# EasyEDA Pro project 毕设.eprj, schematic Schematic2
Board Name: 电源板; Create Date: 2025-04-13; Page Name: P1; Project Name: 毕设; Schematic Name: Schematic2; Update Date: 2025-04-14; Company: 嘉立创EDA; Page Size: A4; Version: V1.0
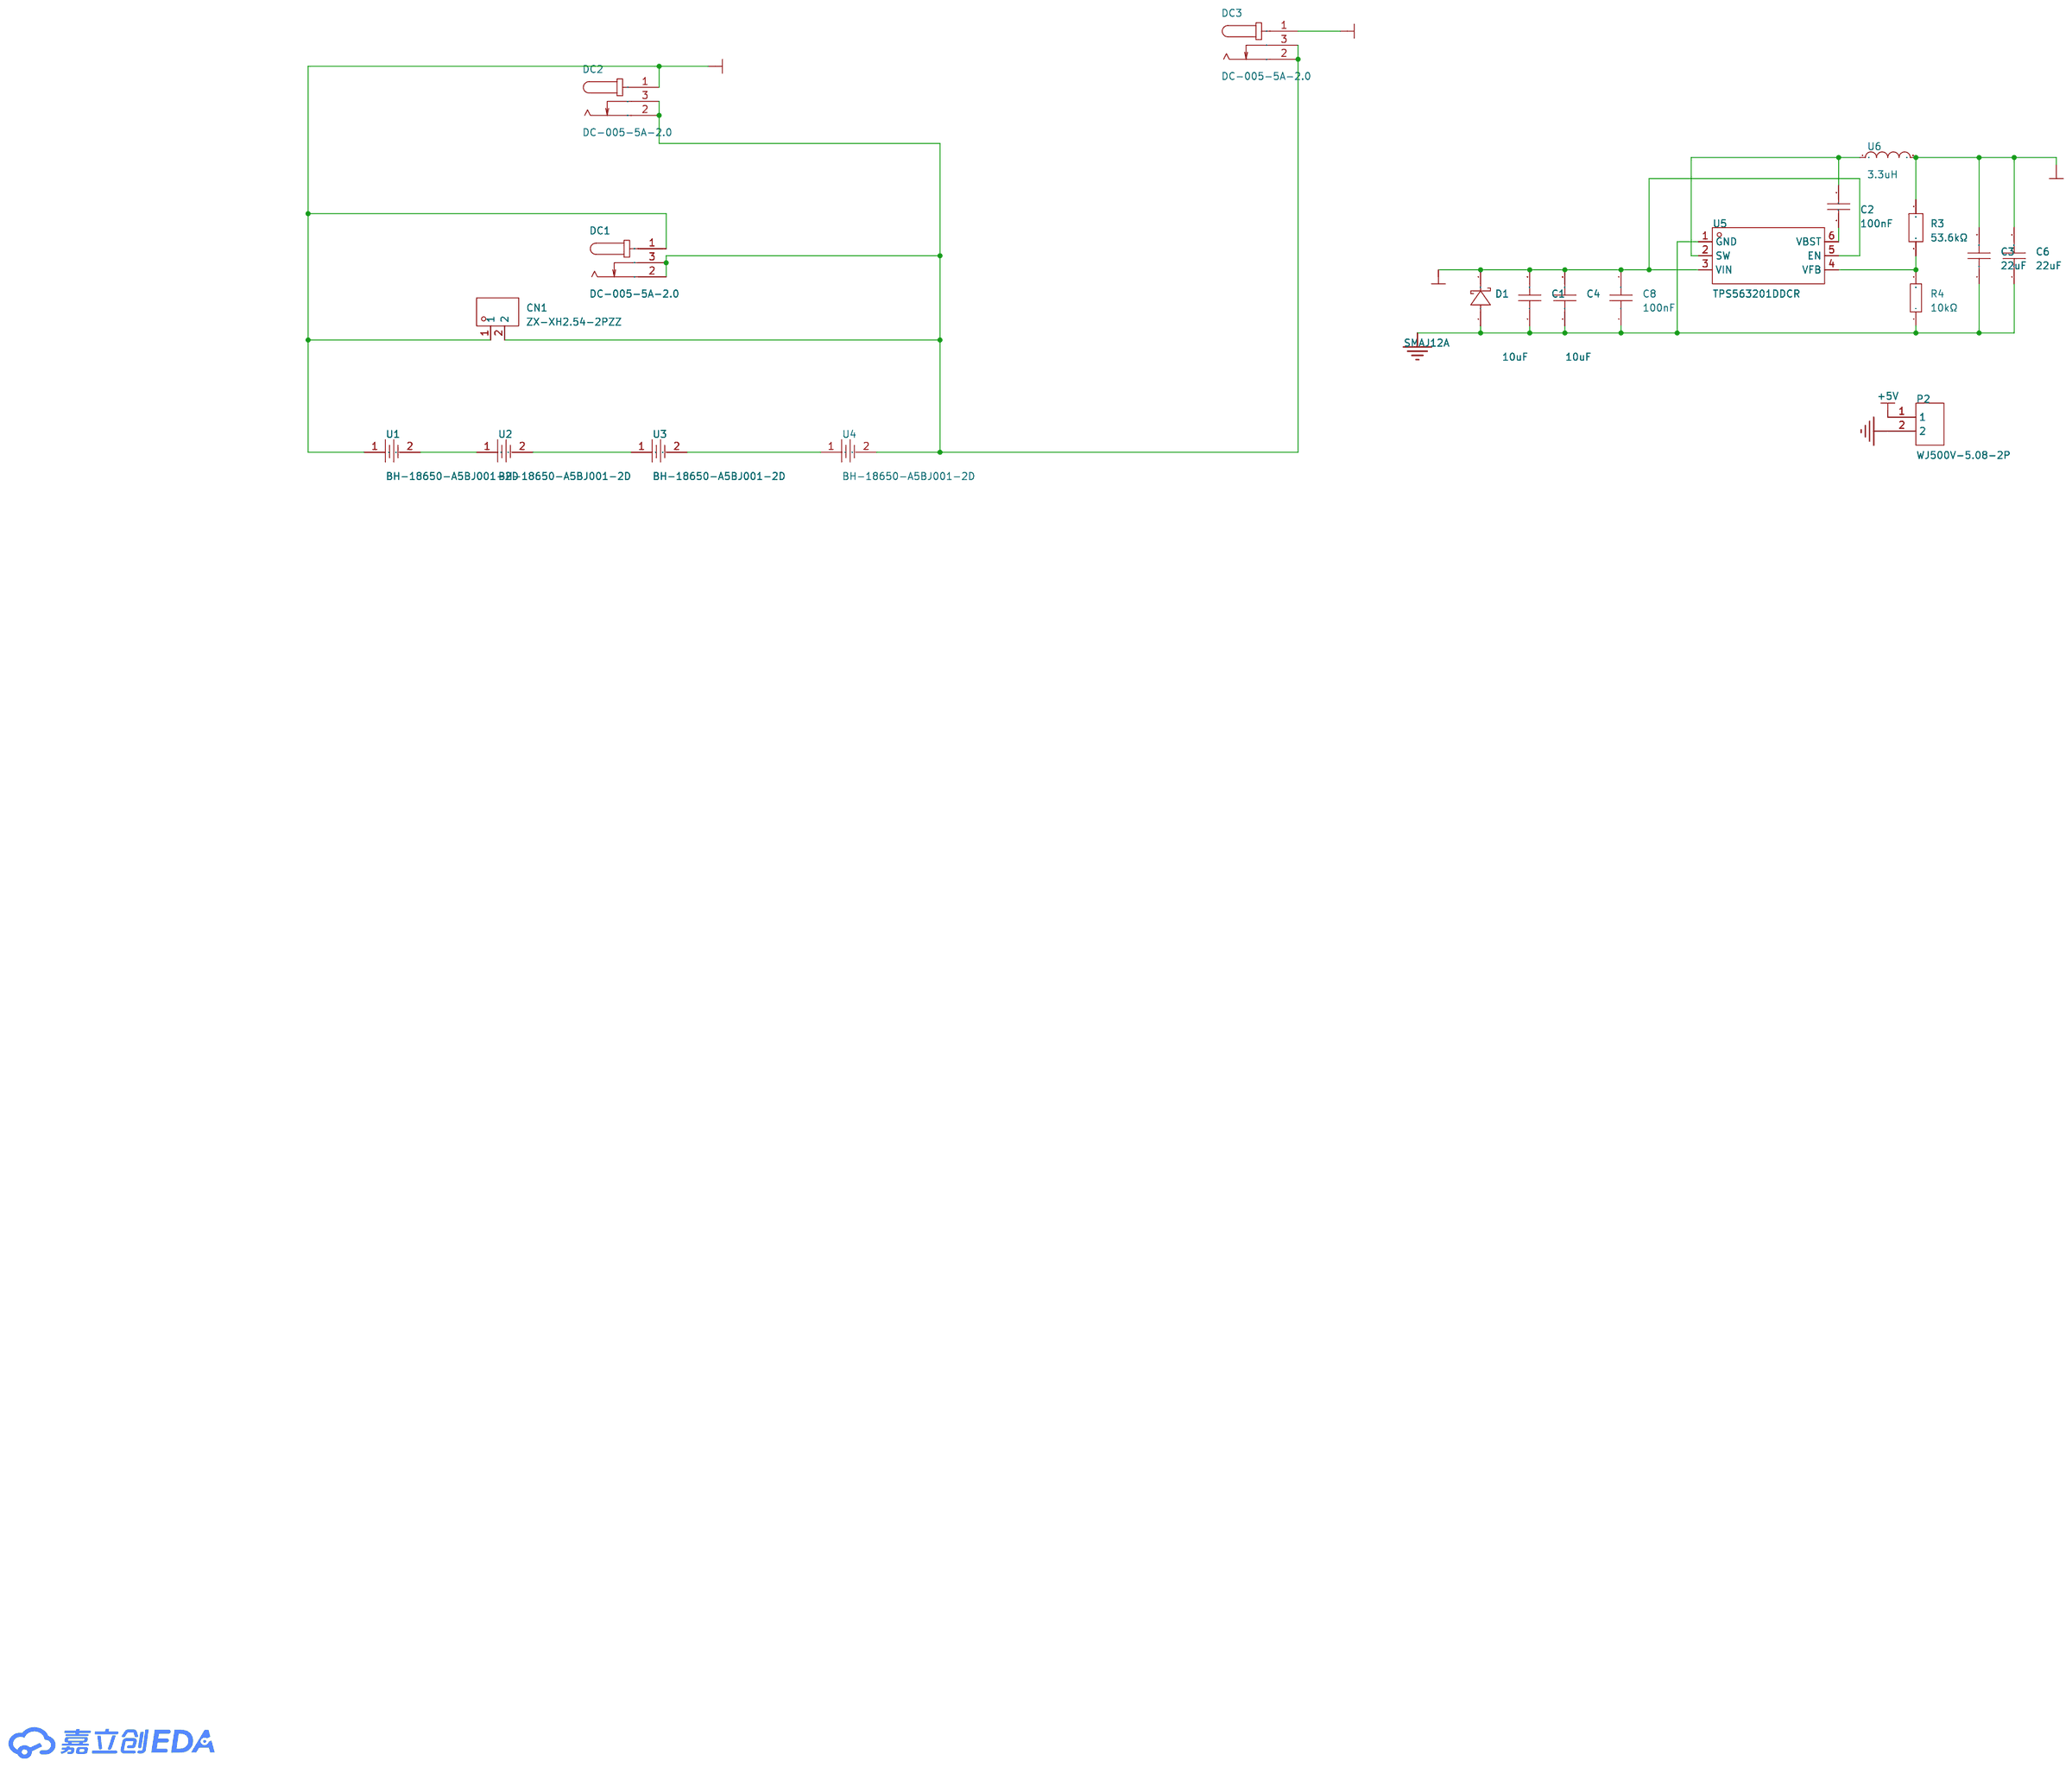
[diagram p1: schematic sheet]

## Parts
C1  10uF  [C0805]
C2  100nF  [C0603]
C3  22uF  [C0603]
C4  10uF  [C0805]
C6  22uF  [C0603]
C8  100nF  [C0603]
CN1  ZX-XH2.54-2PZZ  [CONN-TH_2P-P2.50_HX25003-2A]
D1  SMAJ12A  [DO-214AC_L4.3-W2.7-LS5.0-RD]
DC1  DC-005-5A-2.0  [DC-IN-TH_DC-005-5A-2.0]
DC2  DC-005-5A-2.0  [DC-IN-TH_DC-005-5A-2.0]
DC3  DC-005-5A-2.0  [DC-IN-TH_DC-005-5A-2.0]
P2  WJ500V-5.08-2P  [CONN-TH_2P-P5.00_WJ500V-5.08-2P]
R3  53.6kΩ  [R0603]
R4  10kΩ  [R0603]
U1  BH-18650-A5BJ001-2D  [BAT-TH_BH-18650-A5BJ001-2D]
U2  BH-18650-A5BJ001-2D  [BAT-TH_BH-18650-A5BJ001-2D]
U3  BH-18650-A5BJ001-2D  [BAT-TH_BH-18650-A5BJ001-2D]
U4  BH-18650-A5BJ001-2D  [BAT-TH_BH-18650-A5BJ001-2D]
U5  TPS563201DDCR  [SOT-23-6_L2.9-W1.6-P0.95-LS2.8-BR]
U6  3.3uH  [IND-SMD_L7.4-W6.6]

## Library data of the parts
C1 C4 = CGA0805X5R106K350MT: 容值:10uF;精度:±10%;额定电压:35V;材质(温度系数):X5R;; LCSC Part Name: 10uF ±10% 35V; Supplier Part: C6119888; Manufacturer: HRE(芯声); Supplier Footprint: 0805; JLCPCB Part Class: 扩展库; Supplier: LCSC; Tolerance: ±10%; Voltage Rated: 35V; Temperature Coefficient: X5R
C2 = CL10B104KA8NNNC: 容值:100nF;精度:±10%;额定电压:25V;材质(温度系数):X7R;; LCSC Part Name: 100nF ±10% 25V; Supplier Part: C1590; Manufacturer: SAMSUNG(三星); Supplier Footprint: 0603; JLCPCB Part Class: 扩展库; Datasheet: https://atta.szlcsc.com/upload/public/pdf/source/20160218/1457707763339.pdf; Supplier: LCSC; Tolerance: ±10%; Voltage Rated: 25V; Temperature Coefficient: X7R
C3 C6 = HGC0603R5226M100NTHJ: 容值:22uF;精度:±20%;额定电压:10V;材质(温度系数):X5R;; LCSC Part Name: 22uF ±20% 10V; Supplier Part: C7432770; Manufacturer: Chinocera(华瓷); Supplier Footprint: 0603; JLCPCB Part Class: 扩展库; Datasheet: https://atta.szlcsc.com/upload/public/pdf/source/20240320/FAC3FEC40A78BC5CCCE96C232A94D860.pdf; Supplier: LCSC; Tolerance: ±20%; Voltage Rated: 10V; Temperature Coefficient: X5R
C8 = CGA0603X7R104K500JT: 容值:100nF;精度:±10%;额定电压:50V;材质(温度系数):X7R;; LCSC Part Name: 100nF ±10% 50V; Supplier Part: C6119867; Manufacturer: HRE(芯声); Supplier Footprint: 0603; JLCPCB Part Class: 扩展库; Supplier: LCSC; Tolerance: ±10%; Voltage Rated: 50V; Temperature Coefficient: X7R
CN1 = ZX-XH2.54-2PZZ: LCSC Part Name: 1x2P 间距:2.5mm 直插 系列:XH; Supplier Part: C7429632; Manufacturer: Megastar(兆星); Supplier Footprint: 插件,P=2.5mm; JLCPCB Part Class: 扩展库; Datasheet: https://atta.szlcsc.com/upload/public/pdf/source/20230619/19BA6947230AA44A04D3EDD65E618FD0.pdf; Supplier: LCSC; Pins Structure: 1x2P; Pitch: 2.5mm; Mounting Type: 直插; Reference Series: XH; Number of Pins: 2P; Number of Rows: 1; Number of PINs Per Row: 2; Rated Current: 3A; Contact Material: 黄铜; Contact Plating: 锡; Operating Temperature: -25℃~+85℃; Rated Voltage (Max): 250V; Plastic Material: PA66; Flame Retardant Rating: UL94V-0; Color: 白色; Z-Height of the Board: 7mm; X-Length of Bottom Edge on Board (Spacing Line): 7.5mm; Y-Width of Bottom Edge on Board: 5.9mm
D1 = SMAJ12A_C908766: 反向截止电压(Vrwm):12V;最大钳位电压:19.9V;峰值脉冲电流(Ipp):20.1A;峰值脉冲功率(Ppp):400W;击穿电压:13.3V;; LCSC Part Name: 单向TVS 12V截止 20.1A峰值脉冲; Supplier Part: C908766; Manufacturer: GOODWORK(固得沃克); Supplier Footprint: SMA(DO-214AC); JLCPCB Part Class: 扩展库; Datasheet: https://atta.szlcsc.com/upload/public/pdf/source/20240508/8B44FA02DF89A45C8C3EB0325515EF7C.pdf; Supplier: LCSC; Reverse Stand-Off Voltage (Vrwm): 12V; Maximum Clamping Voltage: 19.9V; Peak Pulse Current (Ipp): 20.1A; Peak Pulse Power Dissipation (Ppp): 400W; Breakdown Voltage: 13.3V; Reverse Leakage Current (Ir): 5uA; Operating Temperature: -55℃~+150℃@(Tj); Type: TVS
DC1-DC3 = DC-005-5A-2.0: LCSC Part Name: DC电源插座 内径:2mm 外径:6.2mm; Supplier Part: C381116; Manufacturer: XKB Connection(中国星坤); Supplier Footprint: 插件; JLCPCB Part Class: 扩展库; Datasheet: https://atta.szlcsc.com/upload/public/pdf/source/20211015/707A35F7AB6E89C57AAB641950105BB7.pdf; Supplier: LCSC; Connector Type: DC电源插座; Mounting Style: 弯插; Inside Contact Diameter: 2mm; Outside Contact Diameter: 6.2mm; Current Rating (Max): 5A; Voltage Rating (Max): 24V; Operating Temperature Range: -20℃~+70℃
P2 = WJ500V-5.08-2P: 结构:1x2P;间距:5.08mm;颜色:绿色;安装方式:直插;额定电流:18A;额定电压:250V;排数:1;线规 - AWG:14~30;线规 - 平方毫米:2.5;每排PIN数:2;触头材质:-;触头镀层:-;工作温度范围:-40℃~+105℃;焊接温度(最大值):-;; LCSC Part Name: 1x2P 5.08mm 直插 排数:1 每排P数:2; Supplier Part: C8465; Manufacturer: KANGNEX(康奈克斯电气); Supplier Footprint: 插件,P=5.08mm; JLCPCB Part Class: 扩展库; Datasheet: https://atta.szlcsc.com/upload/public/pdf/source/20191225/C8465_02D34CE5B5B4A53DF5891601D97FA9F4.pdf; Supplier: LCSC; Structure: 1x2P; Pitch: 5.08mm; Color: 绿色; Mounting Style: 直插; Current Rating (Max): 18A; Voltage Rating (Max): 250V; Number of Pins: 2P; Number of Rows: 1; Wire Gauge - AWG: 14~30; Wire Gauge - mm2: 2.5; Number of PINs Per Row: 2; Operating Temperature Range: -40℃~+105℃; Screw Specification: M2.5
R3 = FRC0603F5362TS: 电阻类型:厚膜电阻;阻值:53.6kΩ;精度:±1%;功率:100mW;最大工作电压:75V;温度系数:±100ppm/℃;; LCSC Part Name: 53.6kΩ ±1% 100mW 厚膜电阻; Supplier Part: C2930115; Manufacturer: FOJAN(富捷); Supplier Footprint: 0603; JLCPCB Part Class: 扩展库; Datasheet: https://atta.szlcsc.com/upload/public/pdf/source/20211221/925EC7D7225764EE0046F22065062C87.pdf; Supplier: LCSC; Type: 厚膜电阻; Tolerance: ±1%; Power(Watts): 100mW; Overload Voltage (Max): 75V; Temperature Coefficient: ±100ppm/℃; Operating Temperature Range: -55℃~+155℃
R4 = 0603WAF1002T5E: 电阻类型:厚膜电阻;阻值:10kΩ;精度:±1%;功率:100mW;最大工作电压:75V;温度系数:±100ppm/℃;; LCSC Part Name: 厚膜电阻 10kΩ ±1% 100mW; Supplier Part: C25804; Manufacturer: UNI-ROYAL(厚声); Supplier Footprint: 0603; JLCPCB Part Class: 基础库; Datasheet: https://atta.szlcsc.com/upload/public/pdf/source/20200306/C422600_1E6D84923E4A46A82E41ADD87F860B5C.pdf; Supplier: LCSC; Type: 厚膜电阻; Tolerance: ±1%; Power(Watts): 100mW; Overload Voltage (Max): 75V; Temperature Coefficient: ±100ppm/℃; Operating Temperature Range: -55℃~+155℃
U1-U4 = BH-18650-A5BJ001-2D: LCSC Part Name: 电池盒; Supplier Part: C19184083; Manufacturer: MYOUNG(美阳); Supplier Footprint: 插件; JLCPCB Part Class: 扩展库; Datasheet: https://atta.szlcsc.com/upload/public/pdf/source/20231108/7CF586EC5DCFE5D582991176466319C5.pdf; Supplier: LCSC; Connector Type: 电池盒; Contact Plating: 镍; Operating Temperature Range: -10℃~+100℃
U5 = TPS563201DDCR: 功能类型:降压型;输出类型:可调;输入电压:4.5V~17V;输出电压:768mV~7V;输出电流:3A;; LCSC Part Name: 4.5V至17V输入,3A同步降压电压调节器; Supplier Part: C116592; Manufacturer: TI(德州仪器); Supplier Footprint: SOT-23-THIN-6; JLCPCB Part Class: 扩展库; Datasheet: https://atta.szlcsc.com/upload/public/pdf/source/20230424/FEEFD13F14AFA838E4C009B2DDC1DFA0.pdf; Supplier: LCSC; Function: 降压型; Output Type: 可调; Input Voltage: 4.5V~17V; Output Voltage: 768mV~7V; Output Current: 3A; Switching Frequency: 580kHz; Operating Temperature: -40℃~+125℃@(TJ); Synchronous Rectification: 是; Number of Outputs: 1; Topology: 降压式; Switch tube (built-in/external): 内置
U6 = FDVE0630-H-3R3M=P3: 电感值:3.3uH;精度:±20%;额定电流:5.3A;饱和电流(Isat):-;直流电阻(DCR):25.4mΩ;; LCSC Part Name: 3.3uH ±20%; Supplier Part: C907934; Manufacturer: muRata(村田); Supplier Footprint: SMD,6.6x7.4mm; JLCPCB Part Class: 扩展库; Datasheet: https://atta.szlcsc.com/upload/public/pdf/source/20201022/C907934_A12BEBCEF0936F6BC4224EFDE20F99C5.pdf; Supplier: LCSC; Tolerance: ±20%; Rated Current: 5.3A; DC Resistance (DCR): 25.4mΩ

## Nets
12V: C1.2 C4.2 C8.2 CN1.1 D1.1(K) DC1.1 DC2.1 DC3.1 U1.1 U5.3(VIN) U5.5(EN)
+5V: C3.2 C6.2 P2.1 R3.2 U6.2
GND: C1.1 C3.1 C4.1 C6.1 C8.1 CN1.2 D1.2(A) DC1.2 DC1.3 DC2.2 DC2.3 DC3.2 DC3.3 P2.2 R4.1 U4.2 U5.1(GND)
$1N199: U2.2 U3.1
$1N286: U3.2 U4.1
$1N539: U1.2 U2.1
Net-(C2-1): C2.1 U5.2(SW) U6.1
Net-(C2-2): C2.2 U5.6(VBST)
Net-(R3-1): R3.1 R4.2 U5.4(VFB)
